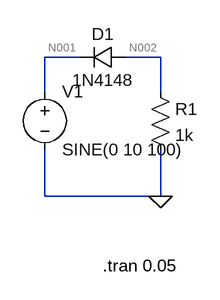
[diagram p0: schematic Draft1.asc]
Draft1.asc, the LTspice schematic file:
Version 4.1
SHEET 1 880 680
WIRE 80 80 32 80
WIRE 192 80 144 80
WIRE 32 128 32 80
WIRE 192 128 192 80
WIRE 32 272 32 208
WIRE 192 272 192 208
WIRE 192 272 32 272
FLAG 192 272 0
SYMBOL voltage 32 112 R0
WINDOW 123 0 0 Left 0
WINDOW 39 0 0 Left 0
SYMATTR InstName V1
SYMATTR Value SINE(0 10 100)
SYMBOL diode 144 64 R90
WINDOW 0 0 32 VBottom 2
WINDOW 3 32 32 VTop 2
SYMATTR InstName D1
SYMATTR Value 1N4148
SYMBOL res 176 112 R0
SYMATTR InstName R1
SYMATTR Value 1k
TEXT 112 368 Left 2 !.tran 0.05

The netlist it stands for:
* Draft1.asc
V1 N001 0 SINE(0 10 100)
D1 N002 N001 1N4148
R1 N002 0 1k
.model D D
.lib standard.dio
.tran 0.05
.backanno
.end

* Results of the author's LTspice run, read from the files saved beside the schematic
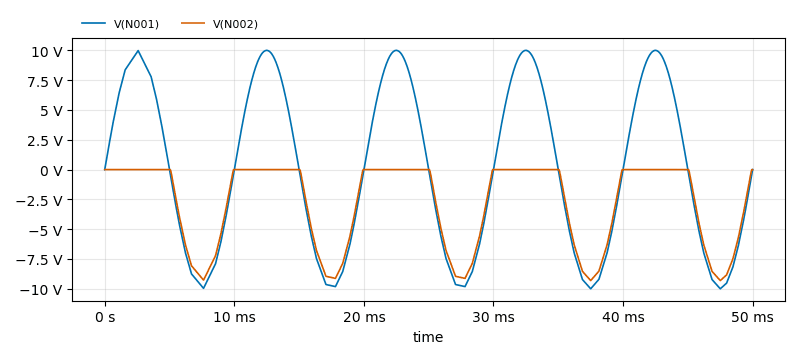
[diagram p1: Transient Analysis of Draft1.asc, plotted from the saved traces]
* Transient Analysis, 1 run:
*   V(N001): min -10 V, max 10 V, average 24.56 mV, rms 7.025 V, last 0 V
*   V(N002): min -9.309 V, max 59.27 µV, average -2.823 V, rms 4.53 V, last 981.8 nV